# Altium schematic sheet 05_3V3_GENERATION.SchDoc: =TitleParameter
size A3; Organization: ASISGUARD; Address1: Kemalpasa, Kemalpasa Cd. No:290 D:292H, 35060 Bornova/Izmir/Turkey; SheetNumber: 5; SheetTotal: 12
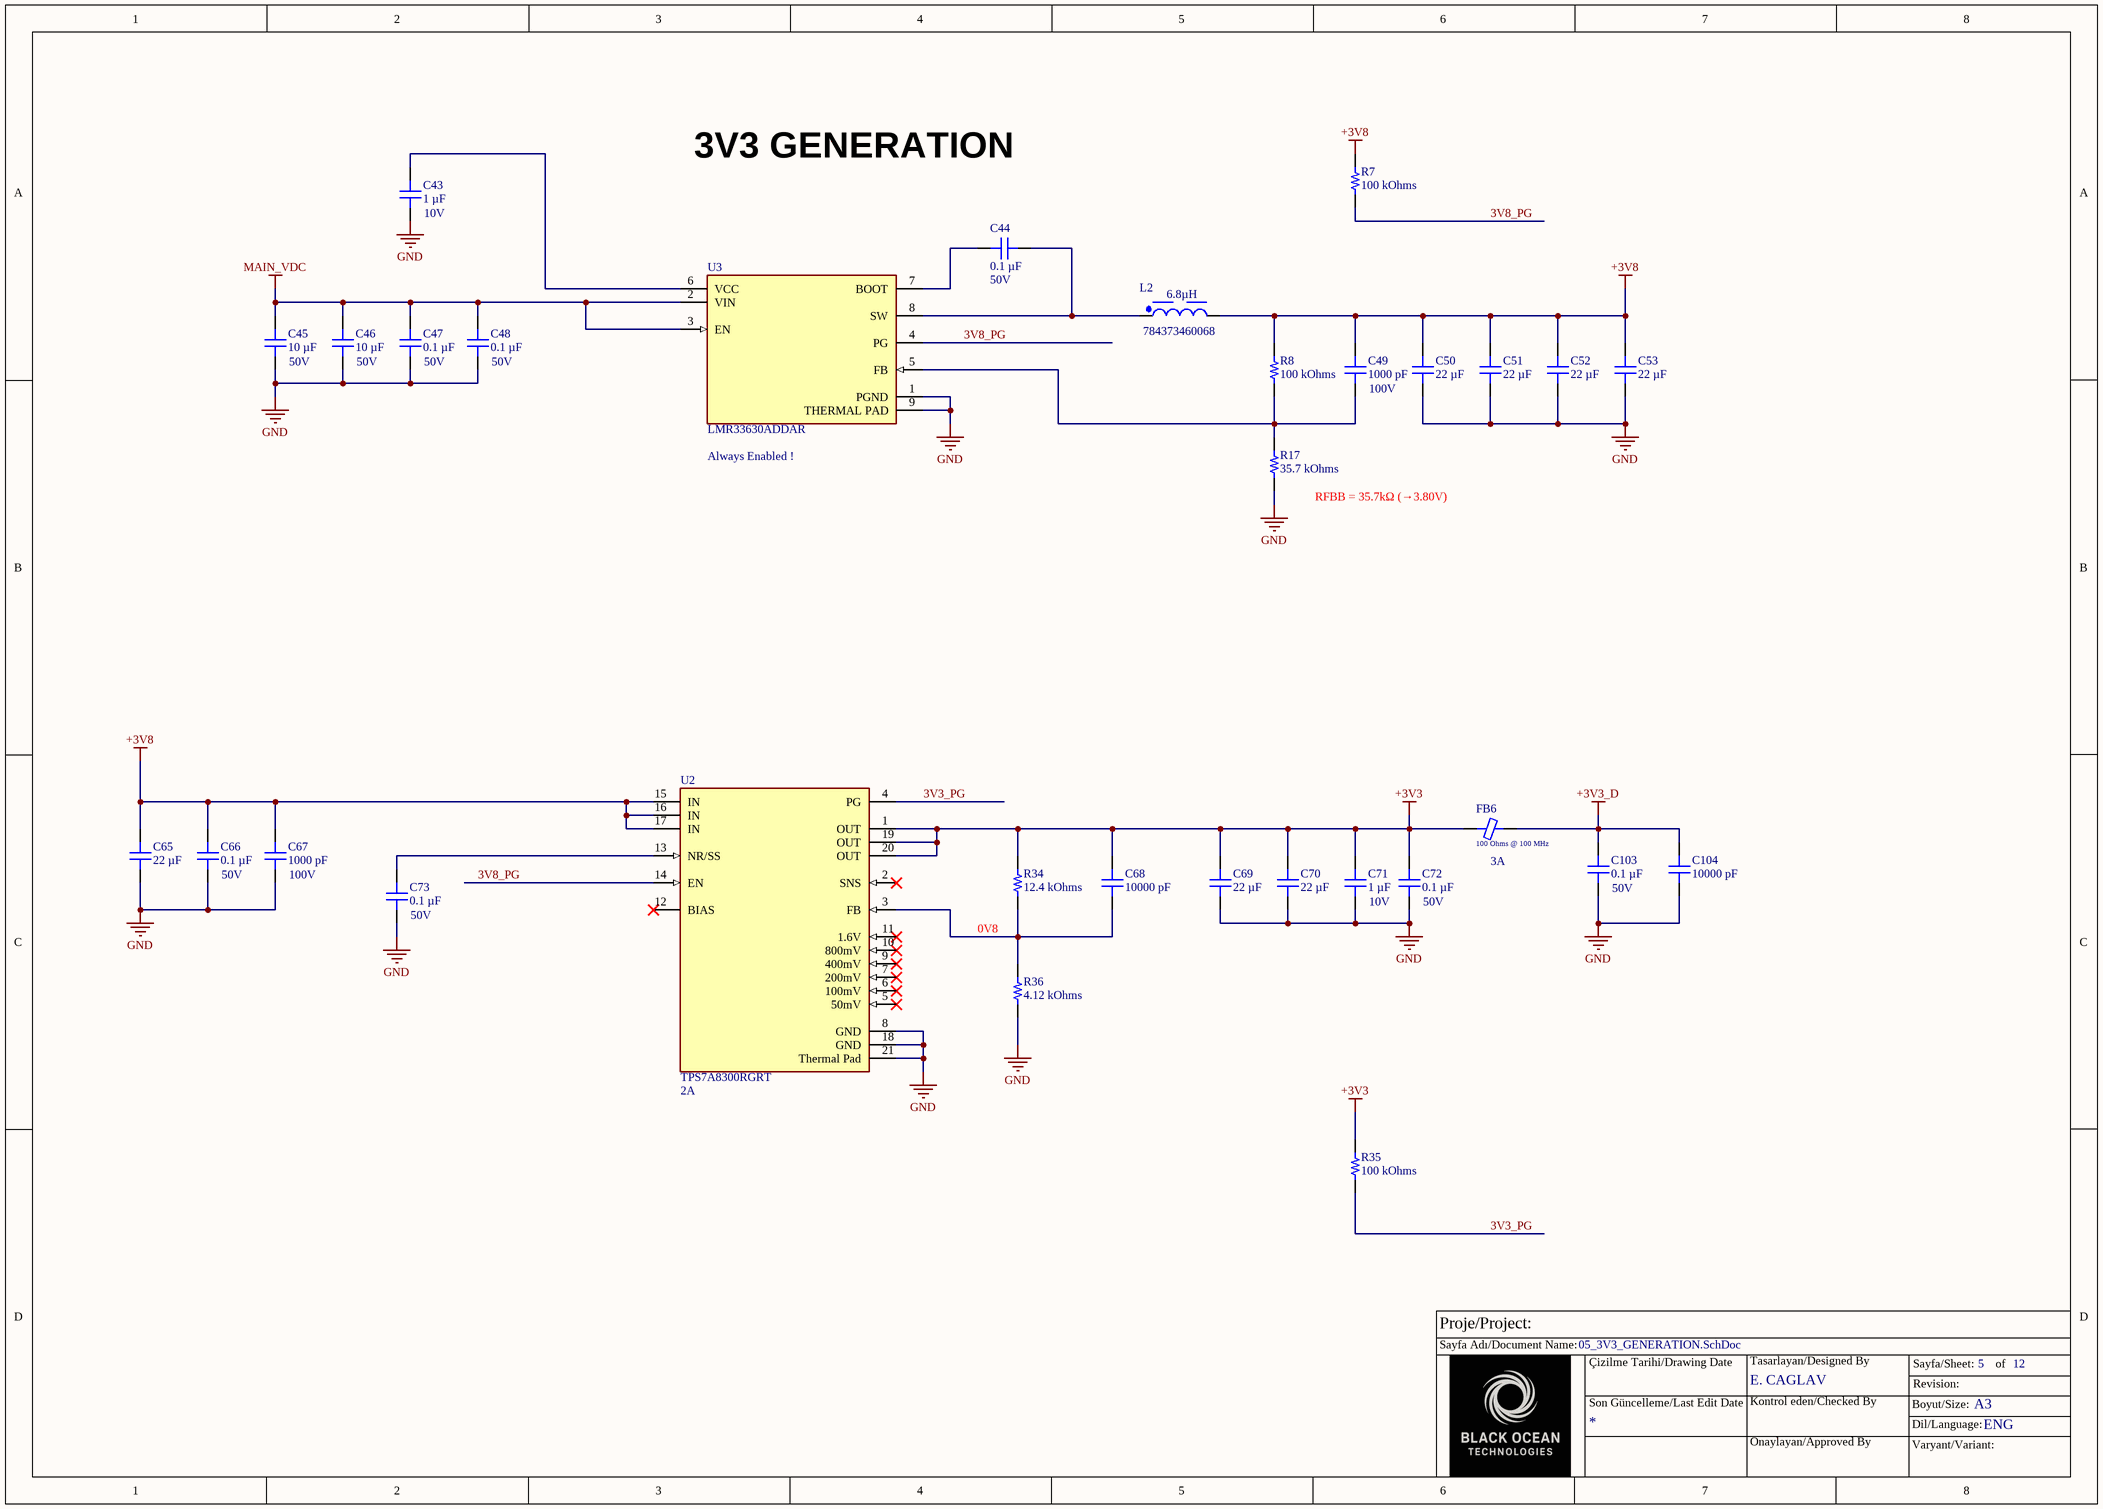
[diagram p0: 05_3V3_GENERATION.SchDoc]

## Parts
C43  Voltage - Rated: 10V  [CAP 0402_1005]  (hidden comment: 1 µF)
C44  Voltage - Rated: 50V  [CAP 0402_1005]  (hidden comment: 0.1 µF)
C45  Voltage - Rated: 50V  [CAP 1206_3216 - 0.8MM]  (hidden comment: 10 µF)
C46  Voltage - Rated: 50V  [CAP 1206_3216 - 0.8MM]  (hidden comment: 10 µF)
C47  Voltage - Rated: 50V  [CAP 0402_1005]  (hidden comment: 0.1 µF)
C48  Voltage - Rated: 50V  [CAP 0402_1005]  (hidden comment: 0.1 µF)
C49  Voltage - Rated: 100V  [CAP 0402_1005]  (hidden comment: 1000 pF)
C50  22 µF  [CAP 0805_2012]
C51  22 µF  [CAP 0805_2012]
C52  22 µF  [CAP 0805_2012]
C53  22 µF  [CAP 0805_2012]
C65  22 µF  [CAP 0805_2012]
C66  Voltage - Rated: 50V  [CAP 0402_1005]  (hidden comment: 0.1 µF)
C67  Voltage - Rated: 100V  [CAP 0402_1005]  (hidden comment: 1000 pF)
C68  10000 pF  [CAP 0402_1005]
C69  22 µF  [CAP 0805_2012]
C70  22 µF  [CAP 0805_2012]
C71  Voltage - Rated: 10V  [CAP 0402_1005]  (hidden comment: 1 µF)
C72  Voltage - Rated: 50V  [CAP 0402_1005]  (hidden comment: 0.1 µF)
C73  Voltage - Rated: 50V  [CAP 0402_1005]  (hidden comment: 0.1 µF)
C103  Voltage - Rated: 50V  [CAP 0402_1005]  (hidden comment: 0.1 µF)
C104  10000 pF  [CAP 0402_1005]
FB6  100 Ohms @ 100 MHz  Current Rating (Max): 3A  [FER 0603_1608]
L2  784373460068  Inductance: 6.8µH  [WE-LHCA_7030]
R7  100 kOhms  [RES 0402_1005]
R8  100 kOhms  [RES 0402_1005]
R17  35.7 kOhms  [RES 0402_1005]
R34  12.4 kOhms  [RES 0402_1005]
R35  100 kOhms  [RES 0402_1005]
R36  4.12 kOhms  [RES 0402_1005]
U2  TPS7A8300RGRT  Output Current: 2A  [FP-RGR0020A-MFG]
U3  LMR33630ADDAR  [FP-DDA0008J-MFG]

## Nets
+3V3: C68.2 C69.2 C70.2 C71.1 C72.2 FB6.2 R34.2 R35.2 U2.1(OUT) U2.19(OUT) U2.20(OUT)
+3V3_D: C103.2 C104.2 FB6.1
+3V8: C49.2 C50.2 C51.2 C52.2 C53.2 C65.2 C66.2 C67.2 L2.2 R7.2 R8.2 U2.15(IN) U2.16(IN) U2.17(IN)
GND: C43.2 C45.1 C46.1 C47.1 C48.1 C50.1 C51.1 C52.1 C53.1 C65.1 C66.1 C67.1 C69.1 C70.1 C71.2 C72.1 C73.1 C103.1 C104.1 R17.1 R36.1 U2.8(GND) U2.18(GND) U2.21(Thermal_Pad) U3.1(PGND) U3.9(THERMAL_PAD)
MAIN_VDC: C45.2 C46.2 C47.2 C48.2 U3.2(VIN) U3.3(EN)
3V3_PG: R35.1 U2.4(PG)
3V8_PG: R7.1 U2.14(EN) U3.4(PG)
NetC43_1: C43.1 U3.6(VCC)
NetC44_1: C44.1 L2.1 U3.8(SW)
NetC44_2: C44.2 U3.7(BOOT)
NetC49_1: C49.1 R8.1 R17.2 U3.5(FB)
NetC68_1: C68.1 R34.1 R36.2 U2.3(FB)
NetC73_2: C73.2 U2.13(NR/SS)

Not connected (* = marked no-connect by the designer): U2 2(SNS)* 5(50mV)* 6(100mV)* 7(200mV)* 9(400mV)* 10(800mV)* 11(1.6V)* 12(BIAS)*

## Notes on the sheet
- 3V3 GENERATION
- (near U3) Always Enabled !
- (near R17) RFBB = 35.7kΩ (→3.80V)
- 0V8
- Proje/Project:
- Sayfa Adı/Document Name:
- Çizilme Tarihi/Drawing Date
- E. CAGLAV
- Tasarlayan/Designed By
- Sayfa/Sheet:
- Revision:
- of
- Son Güncelleme/Last Edit Date
- Kontrol eden/Checked By
- Onaylayan/Approved By
- Boyut/Size:
- Varyant/Variant:
- Dil/Language:
- A3
- ENG

## Library data of the parts
C43 C71 = GRM155C71A105KE11D: CAP CER 1UF 10V X7S 0402; manufacturer: Murata Electronics; Tolerance: ±10%; Part Number: GRM155C71A105KE11D; Capacitance: 1 µF; Applications: General Purpose; componentlink1description: Datasheet; componentlink1url: https://search.murata.co.jp/Ceramy/image/img/A01X/G101/ENG/GRM155C71A105KE11-01.pdf; componentlink2description: DigiKey Link; componentlink2url: https://www.digikey.com/en/products/detail/murata-electronics/GRM155C71A105KE11D/6606086; Device Package: 0402 (1005 Metric); lastupdated: 4/6/2026 7:11:12 PM; Lifecycle Status: Active; Minimum Order: 1; Mounting Type: Surface Mount, MLCC; Operating Temperature: -55°C ~ 125°C; Package / Case: 0402 (1005 Metric); packaging: TapeAndReel; partid: 1749; Part Status: Active; price: 0.01; series: GRM; Size / Dimension: 0.039" L x 0.020" W (1.00mm x 0.50mm); Supplier 1: DigiKey; Supplier Part Number 1: 490-14457-1-ND; Temperature Coefficient: X7S; Thickness (Max): 0.024" (0.60mm); value: 1 µF
C44 C47 C48 C66 C72 C73 C103 = GCM155R71H104KE02J: CAP CER 0.1UF 50V X7R 0402; manufacturer: Murata Electronics; Tolerance: ±10%; Part Number: GCM155R71H104KE02J; Capacitance: 0.1 µF; Applications: Automotive; componentlink1description: Datasheet; componentlink1url: https://search.murata.co.jp/Ceramy/image/img/A01X/G101/ENG/GCM155R71H104KE02-01.pdf; componentlink2description: DigiKey Link; componentlink2url: https://www.digikey.com/en/products/detail/murata-electronics/GCM155R71H104KE02J/4903705; Device Package: 0402 (1005 Metric); lastupdated: 4/6/2026 7:10:30 PM; Lifecycle Status: Active; Minimum Order: 1; Mounting Type: Surface Mount, MLCC; Operating Temperature: -55°C ~ 125°C; Package / Case: 0402 (1005 Metric); packaging: TapeAndReel; partid: 11356; Part Status: Active; price: 0.01; Ratings: AEC-Q200; series: GCM; Size / Dimension: 0.039" L x 0.020" W (1.00mm x 0.50mm); Supplier 1: DigiKey; Supplier Part Number 1: 490-14514-1-ND; Temperature Coefficient: X7R; Thickness (Max): 0.022" (0.55mm); value: 0.1 µF
C45 C46 = CL31B106KBHNNNE: CAP CER 10UF 50V X7R 1206; manufacturer: Samsung Electro-Mechanics; Tolerance: ±10%; Part Number: CL31B106KBHNNNE; Capacitance: 10 µF; Applications: General Purpose; componentlink1description: Datasheet; componentlink1url: http://www.samsungsem.com/kr/support/product-search/mlcc/CL31B106KBHNNNE.jsp; componentlink2description: DigiKey Link; componentlink2url: https://www.digikey.com/en/products/detail/samsung-electro-mechanics/CL31B106KBHNNNE/5961251; Device Package: 1206 (3216 Metric); lastupdated: 4/6/2026 7:38:00 PM; Lifecycle Status: Active; Minimum Order: 1; Mounting Type: Surface Mount, MLCC; Operating Temperature: -55°C ~ 125°C; Package / Case: 1206 (3216 Metric); packaging: TapeAndReel; partid: 40563; Part Status: Active; price: 0.06; series: CL; Size / Dimension: 0.126" L x 0.063" W (3.20mm x 1.60mm); Supplier 1: DigiKey; Supplier Part Number 1: 1276-6767-1-ND; Temperature Coefficient: X7R; Thickness (Max): 0.071" (1.80mm); value: 10 µF
C49 C67 = C0402H102J1GAC7867: CAP CER 1000PF 100V C0G/NP0 0402; manufacturer: KEMET; Temperature Coefficient: C0G, NP0; Tolerance: ±5%; Part Number: C0402H102J1GAC7867; Capacitance: 1000 pF; Applications: Downhole; componentlink1description: Datasheet; componentlink1url: https://api.kemet.com/component-edge/download/datasheet/C0402H102J1GAC7867.pdf; componentlink2description: DigiKey Link; componentlink2url: https://www.digikey.com/en/products/detail/kemet/C0402H102J1GAC7867/5267578; Device Package: 0402 (1005 Metric); Features: Low ESL, High Temperature; lastupdated: 3/30/2026 7:10:31 PM; Lifecycle Status: Active; Minimum Order: 1; Mounting Type: Surface Mount, MLCC; Operating Temperature: -55°C ~ 200°C; Package / Case: 0402 (1005 Metric); packaging: TapeAndReel; partid: 3822; Part Status: Active; price: 0.24; series: SMD Indust C0G HT200C; Size / Dimension: 0.039" L x 0.020" W (1.00mm x 0.50mm); Supplier 1: DigiKey; Supplier Part Number 1: 399-11931-1-ND; Thickness (Max): 0.022" (0.55mm); value: 1000 pF
C50-C53 C65 C69 C70 = CL21A226KOQNNNE: CAP CER 22UF 16V X5R 0805; manufacturer: Samsung Electro-Mechanics; Tolerance: ±10%; Part Number: CL21A226KOQNNNE; Capacitance: 22 µF; Applications: General Purpose; componentlink1description: Datasheet; componentlink1url: http://www.samsungsem.com/kr/support/library/product-catalog/mlcc.jsp; componentlink2description: DigiKey Link; componentlink2url: https://www.digikey.com/en/products/detail/samsung-electro-mechanics/CL21A226KOQNNNE/5961010; Device Package: 0805 (2012 Metric); lastupdated: 4/6/2026 7:33:17 PM; Lifecycle Status: Active; Minimum Order: 1; Mounting Type: Surface Mount, MLCC; Operating Temperature: -55°C ~ 85°C; Package / Case: 0805 (2012 Metric); packaging: TapeAndReel; partid: 3004; Part Status: Active; price: 0.06; series: CL; Size / Dimension: 0.079" L x 0.049" W (2.00mm x 1.25mm); Supplier 1: DigiKey; Supplier Part Number 1: 1276-6526-1-ND; Temperature Coefficient: X5R; Thickness (Max): 0.055" (1.40mm); value: 22 µF; Voltage - Rated: 16V
C68 C104 = AC0402KPX7R9BB103: CAP CER 10000PF 50V X7R 0402; manufacturer: Yageo; Tolerance: ±10%; Part Number: AC0402KPX7R9BB103; Capacitance: 10000 pF; Applications: Automotive; componentlink1description: Datasheet; componentlink1url: http://www.yageo.com/documents/recent/UPY-AC_NP0X7R_16V-to-630V_12.pdf; componentlink2description: DigiKey Link; componentlink2url: https://www.digikey.com/en/products/detail/yageo/AC0402KPX7R9BB103/6643253; Device Package: 0402 (1005 Metric); lastupdated: 4/6/2026 7:11:07 PM; Lifecycle Status: Active; Minimum Order: 1; Mounting Type: Surface Mount, MLCC; Operating Temperature: -55°C ~ 125°C; Package / Case: 0402 (1005 Metric); packaging: CutTape; partid: 2384; Part Status: Active; price: 0.01; Ratings: AEC-Q200; series: AC; Size / Dimension: 0.039" L x 0.020" W (1.00mm x 0.50mm); Supplier 1: DigiKey; Supplier Part Number 1: 311-3267-1-ND; Temperature Coefficient: X7R; Thickness (Max): 0.022" (0.55mm); value: 10000 pF; Voltage - Rated: 50V
FB6 = MH1608-101Y: FERRITE BEAD 100 OHM 0603 1LN; Manufacturer: Bourns Inc.; DC Resistance (DCR) (Max): 40mOhm; Filter Type: Power, Signal Line; Number of Lines: 1; Part Number: MH1608-101Y; ComponentLink1Description: Datasheet; ComponentLink1URL: https://www.bourns.com/docs/Product-Datasheets/mh.pdf; ComponentLink2Description: DigiKey Link; ComponentLink2URL: https://www.digikey.com/en/products/detail/bourns-inc/MH1608-101Y/2563310; Device Package: 0603 (1608 Metric); Height (Max): 0.039" (1.00mm); Impedance @ Frequency: 100 Ohms @ 100 MHz; LastUpdated: 5/9/2023 8:13:07 PM; Lifecycle Status: Active; Minimum Order: 1; Mounting Type: Surface Mount; Operating Temperature: -55°C ~ 125°C; Package / Case: 0603 (1608 Metric); Packaging: TapeAndReel; PartId: 645; Part Status: Active; Price: 0.02; Series: MH; Size / Dimension: 0.063" L x 0.032" W (1.60mm x 0.80mm); Supplier 1: DigiKey; Supplier Part Number 1: MH1608-101YCT-ND; Value: 100 Ohms @ 100 MHz
L2 = CMP-03913-134708979-2: Power Inductor, 6.8UH, 4.5A, Shielded Rohs Compliant: Yes; DC Resistance (DCR): 49.9mΩ; Current Rating: 4A; Min Operating Temperature: -55°C; Width: 6.5mm; RoHS: Compliant; Max Operating Temperature: 155°C; Ambient Temperature Range High: 100°C; Length: 7mm; Height: 3mm; Ambient Temperature Range Low: -55°C
R7 R35 = AC0402FR-07100KL: RES SMD 100K OHM 1% 1/16W 0402; Manufacturer: Yageo; Power (Watts): 0.063W, 1/16W; Temperature Coefficient: ±100ppm/°C; Part Number: AC0402FR-07100KL; Value: 100 kOhms; ComponentLink1Description: Datasheet; ComponentLink1URL: https://www.yageo.com/upload/media/product/productsearch/datasheet/rchip/PYu-AC_51_RoHS_L_7.pdf; ComponentLink2Description: DigiKey Link; ComponentLink2URL: https://www.digikey.com/en/products/detail/yageo/AC0402FR-07100KL/5895021; Composition: Thick Film; Device Package: 0402 (1005 Metric); Features: Automotive AEC-Q200, Moisture Resistant; Height - Seated (Max): 0.015" (0.37mm); LastUpdated: 4/6/2026 7:41:12 PM; Lifecycle Status: Active; Minimum Order: 1; Number of Terminations: 2; Operating Temperature: -55°C ~ 155°C; Package / Case: 0402 (1005 Metric); Packaging: CutTape; PartId: 12047; Part Status: Active; Price: 0.01; Ratings: AEC-Q200; Resistance: 100 kOhms; Series: AC; Size / Dimension: 0.039" L x 0.020" W (1.00mm x 0.50mm); Supplier 1: DigiKey; Supplier Part Number 1: YAG3434CT-ND; Supplier Device Package: 0402; Tolerance: ±1%
R8 = RC0402FR-13100KL: RES 100K OHM 1% 1/16W 0402; Manufacturer: Yageo; Power (Watts): 0.063W, 1/16W; Temperature Coefficient: ±100ppm/°C; Part Number: RC0402FR-13100KL; Value: 100 kOhms; ComponentLink1Description: Datasheet; ComponentLink1URL: https://www.yageo.com/upload/media/product/productsearch/datasheet/rchip/PYu-RC_Group_51_RoHS_L_11.pdf; ComponentLink2Description: DigiKey Link; ComponentLink2URL: https://www.digikey.com/en/products/detail/yageo/RC0402FR-13100KL/13546624; Composition: Thick Film; Device Package: 0402 (1005 Metric); Features: Moisture Resistant; Height - Seated (Max): 0.016" (0.40mm); LastUpdated: 4/6/2026 7:40:59 PM; Lifecycle Status: Active; Minimum Order: 1; Number of Terminations: 2; Operating Temperature: -55°C ~ 155°C; Package / Case: 0402 (1005 Metric); Packaging: CutTape; PartId: 59069; Part Status: Active; Price: 0.01; Resistance: 100 kOhms; Series: RC_L; Size / Dimension: 0.039" L x 0.020" W (1.00mm x 0.50mm); Supplier 1: DigiKey; Supplier Part Number 1: 13-RC0402FR-13100KLCT-ND; Supplier Device Package: 0402; Tolerance: ±1%
R17 = ERA-2AEB3572X: RES SMD 35.7KOHM 0.1% 1/16W 0402; Manufacturer: Panasonic Electronic Components; Power (Watts): 0.063W, 1/16W; Temperature Coefficient: ±25ppm/°C; Part Number: ERA-2AEB3572X; Value: 35.7 kOhms; ComponentLink1Description: Datasheet; ComponentLink1URL: https://industrial.panasonic.com/cdbs/www-data/pdf/RDM0000/AOA0000C307.pdf; ComponentLink2Description: DigiKey Link; ComponentLink2URL: https://www.digikey.com/en/products/detail/panasonic-electronic-components/ERA-2AEB3572X/2026192; Composition: Thin Film; Device Package: 0402 (1005 Metric); Features: Automotive AEC-Q200; Height - Seated (Max): 0.016" (0.40mm); LastUpdated: 2/9/2024 8:29:52 PM; Lifecycle Status: Active; Minimum Order: 1; Number of Terminations: 2; Operating Temperature: -55°C ~ 155°C; Package / Case: 0402 (1005 Metric); Packaging: TapeAndReel; PartId: 11364; Part Status: Active; Price: 0.04; Ratings: AEC-Q200; Resistance: 35.7 kOhms; Series: ERA-2A; Size / Dimension: 0.039" L x 0.020" W (1.00mm x 0.50mm); Supplier 1: DigiKey; Supplier Part Number 1: P35.7KDCCT-ND; Supplier Device Package: 0402; Tolerance: ±0.1%
R34 = AC0402FR-0712K4L: RES SMD 12.4K OHM 1% 1/16W 0402; Manufacturer: Yageo; Power (Watts): 0.063W, 1/16W; Temperature Coefficient: ±100ppm/°C; Part Number: AC0402FR-0712K4L; Value: 12.4 kOhms; ComponentLink1Description: Datasheet; ComponentLink1URL: https://www.yageo.com/upload/media/product/productsearch/datasheet/rchip/PYu-AC_51_RoHS_L_7.pdf; ComponentLink2Description: DigiKey Link; ComponentLink2URL: https://www.digikey.com/en/products/detail/yageo/AC0402FR-0712K4L/5895055; Composition: Thick Film; Device Package: 0402 (1005 Metric); Features: Automotive AEC-Q200, Moisture Resistant; Height - Seated (Max): 0.015" (0.37mm); LastUpdated: 4/6/2026 7:41:12 PM; Lifecycle Status: Active; Minimum Order: 1; Number of Terminations: 2; Operating Temperature: -55°C ~ 155°C; Package / Case: 0402 (1005 Metric); Packaging: CutTape; PartId: 11140; Part Status: Active; Price: 0.01; Ratings: AEC-Q200; Resistance: 12.4 kOhms; Series: AC; Size / Dimension: 0.039" L x 0.020" W (1.00mm x 0.50mm); Supplier 1: DigiKey; Supplier Part Number 1: YAG5256CT-ND; Supplier Device Package: 0402; Tolerance: ±1%
R36 = ERA-2AEB4121X: RES SMD 4.12KOHM 0.1% 1/16W 0402; Manufacturer: Panasonic Electronic Components; Power (Watts): 0.063W, 1/16W; Temperature Coefficient: ±25ppm/°C; Part Number: ERA-2AEB4121X; Value: 4.12 kOhms; ComponentLink1Description: Datasheet; ComponentLink1URL: https://industrial.panasonic.com/cdbs/www-data/pdf/RDM0000/AOA0000C307.pdf; ComponentLink2Description: DigiKey Link; ComponentLink2URL: https://www.digikey.com/en/products/detail/panasonic-electronic-components/ERA-2AEB4121X/2026108; Composition: Thin Film; Device Package: 0402 (1005 Metric); Features: Automotive AEC-Q200; Height - Seated (Max): 0.016" (0.40mm); LastUpdated: 2/9/2024 8:30:08 PM; Lifecycle Status: Active; Minimum Order: 1; Number of Terminations: 2; Operating Temperature: -55°C ~ 155°C; Package / Case: 0402 (1005 Metric); Packaging: TapeAndReel; PartId: 6142; Part Status: Active; Price: 0.04; Ratings: AEC-Q200; Resistance: 4.12 kOhms; Series: ERA-2A; Size / Dimension: 0.039" L x 0.020" W (1.00mm x 0.50mm); Supplier 1: DigiKey; Supplier Part Number 1: P4.12KDCCT-ND; Supplier Device Package: 0402; Tolerance: ±0.1%
U2 = CMP-2000-07286-2: IC REG LINEAR POS ADJ 2A 20VQFN; Max Output Voltage: 5V; Min Output Voltage: 800mV; Min Input Voltage: 1.1V; Min Current Limit: 2.1A; Power Supply Rejection Ratio (PSRR): 40dB; Quiescent Current: 2.8mA; Accuracy: 1%; Number of Outputs: 1; Max Input Voltage: 6.5V; Output Type: Adjustable; Polarity: Positive; Dropout Voltage: 125mV; Number of Pins: 20; Package Quantity: 250; Lead Free: Lead Free; Packaging: Tape and Reel; RoHS Compliant: Yes; Radiation Hardening: No; Output Voltage: 5V; Case/Package: VQFN; Min Operating Temperature: -40°C; Max Operating Temperature: 125°C; Mount: Surface Mount; REACH SVHC: No SVHC; Max Output Current: 2A; Number of Regulators: 1; Reference Voltage: 800mV; Weight: 0.002469oz; Contact Plating: Gold
U3 = CMP-04918-000184-1: IC REG BUCK ADJUSTABLE 3A 8SOPWR; Switching Frequency: 400kHz; Number of Outputs: 1; Output Configuration: Positive; Synchronous Rectifier: Yes; Min Output Voltage: 1V; Max Output Voltage: 24V; Max Input Voltage: 36V; Min Input Voltage: 3.8V; Output Current: 3A; Min Operating Temperature: -40°C; Max Operating Temperature: 125°C; Number of Pins: 8; RoHS Compliant: Yes; Mount: Surface Mount; Output Type: Adjustable; Packaging: Cut Tape